# Altium project F407.PrjPcb
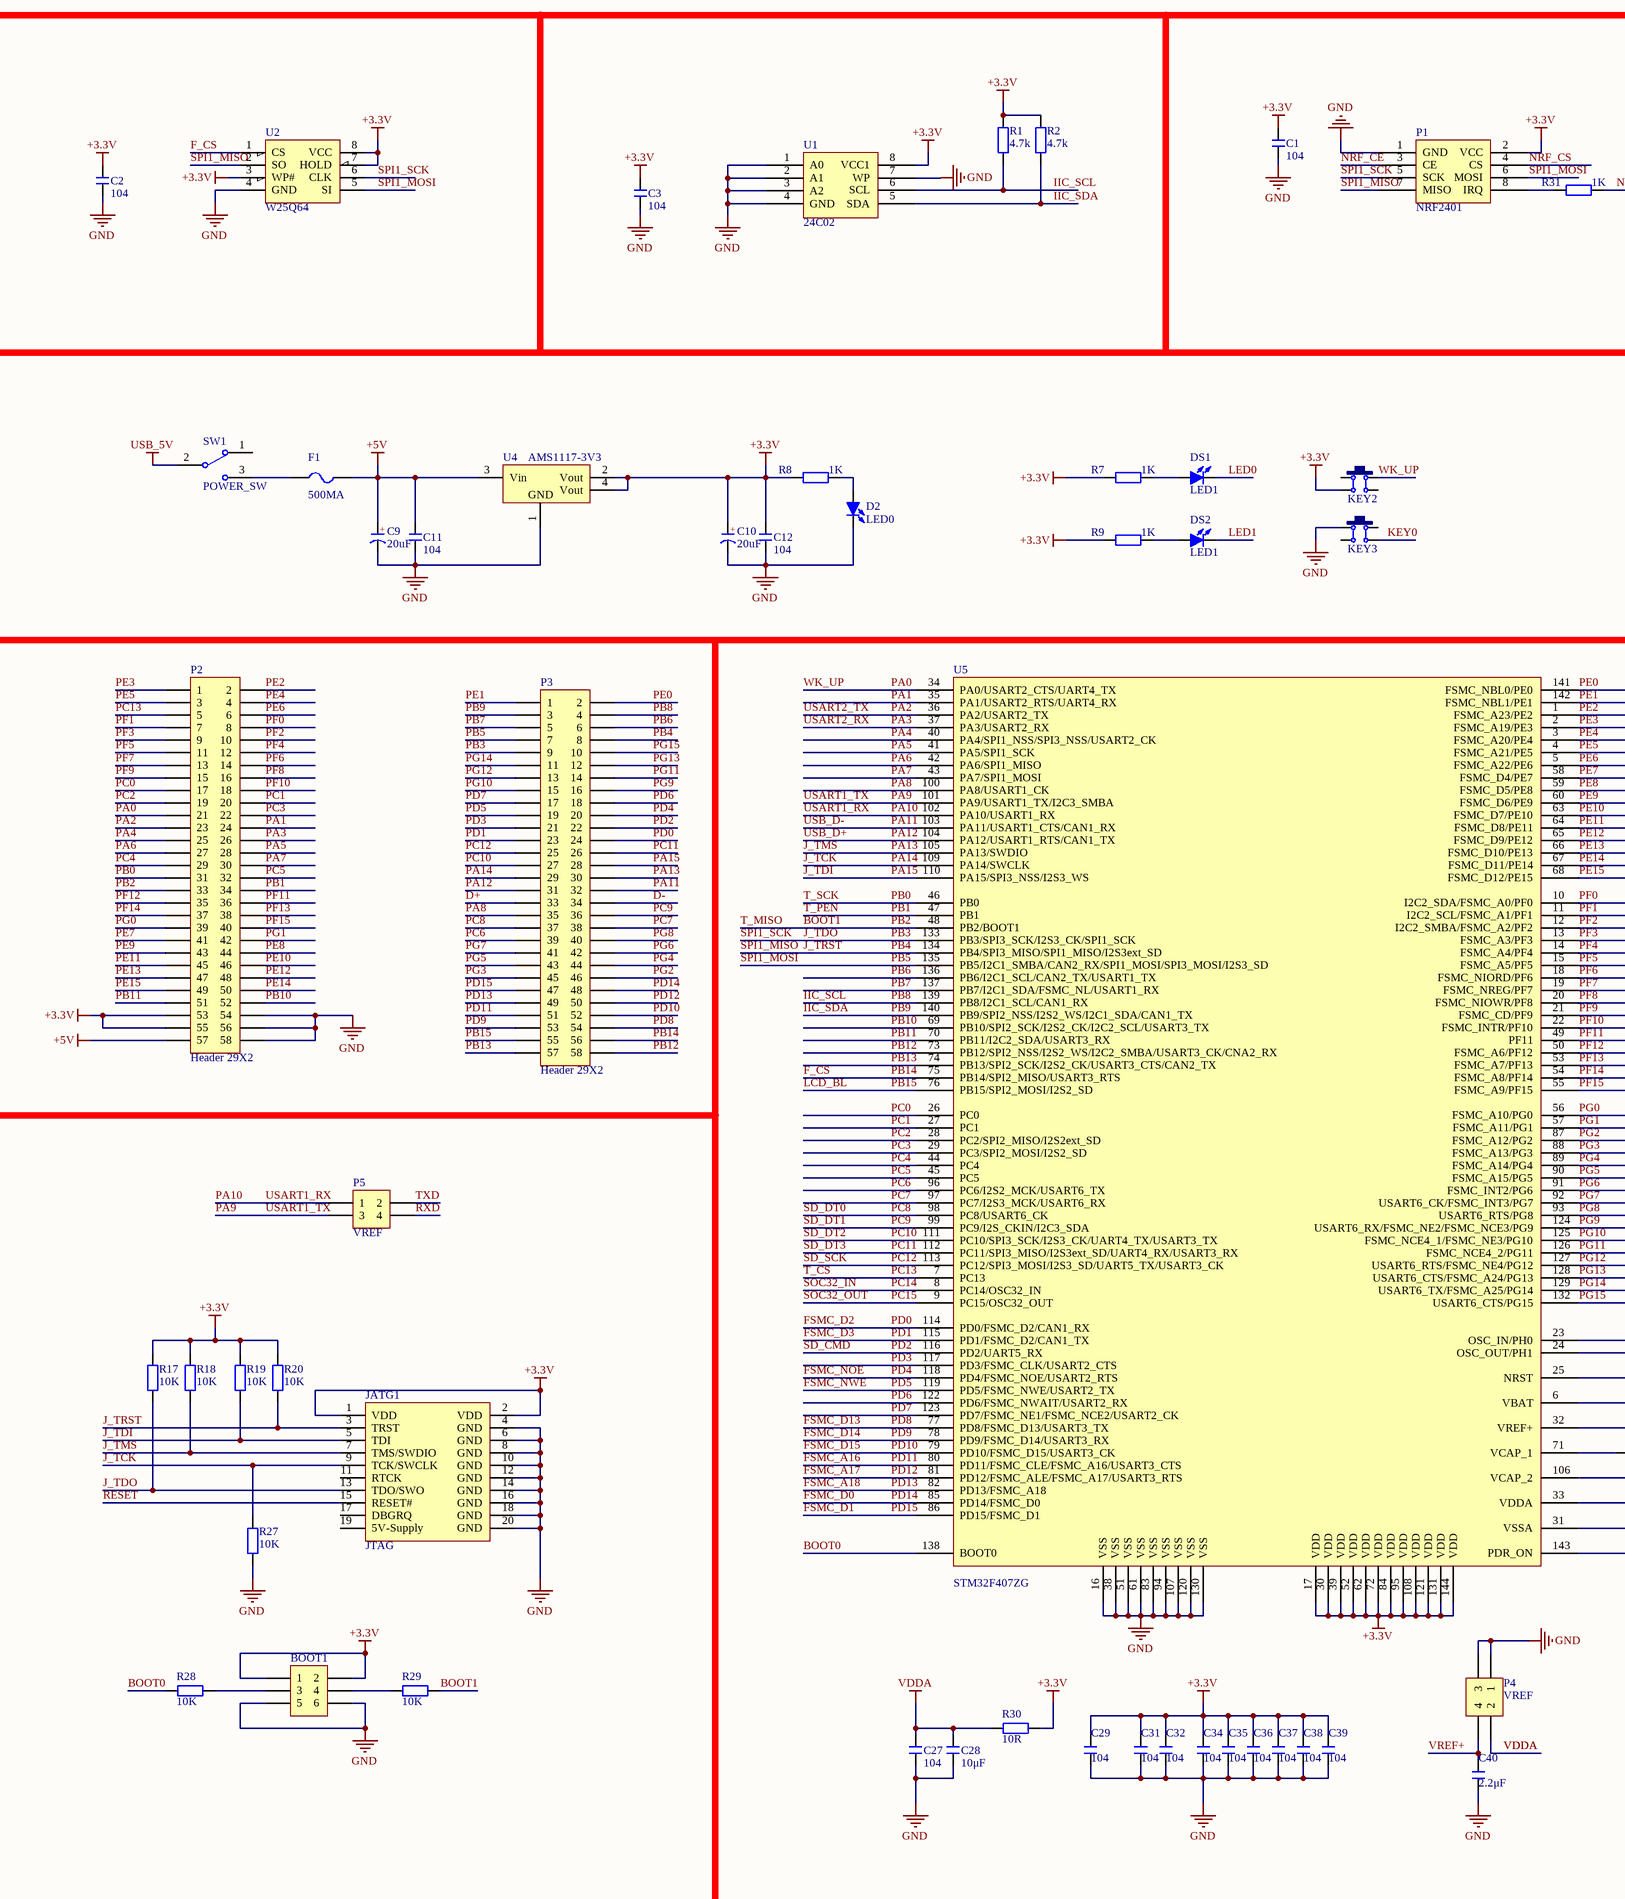
[diagram p0: F407.SchDoc, left]
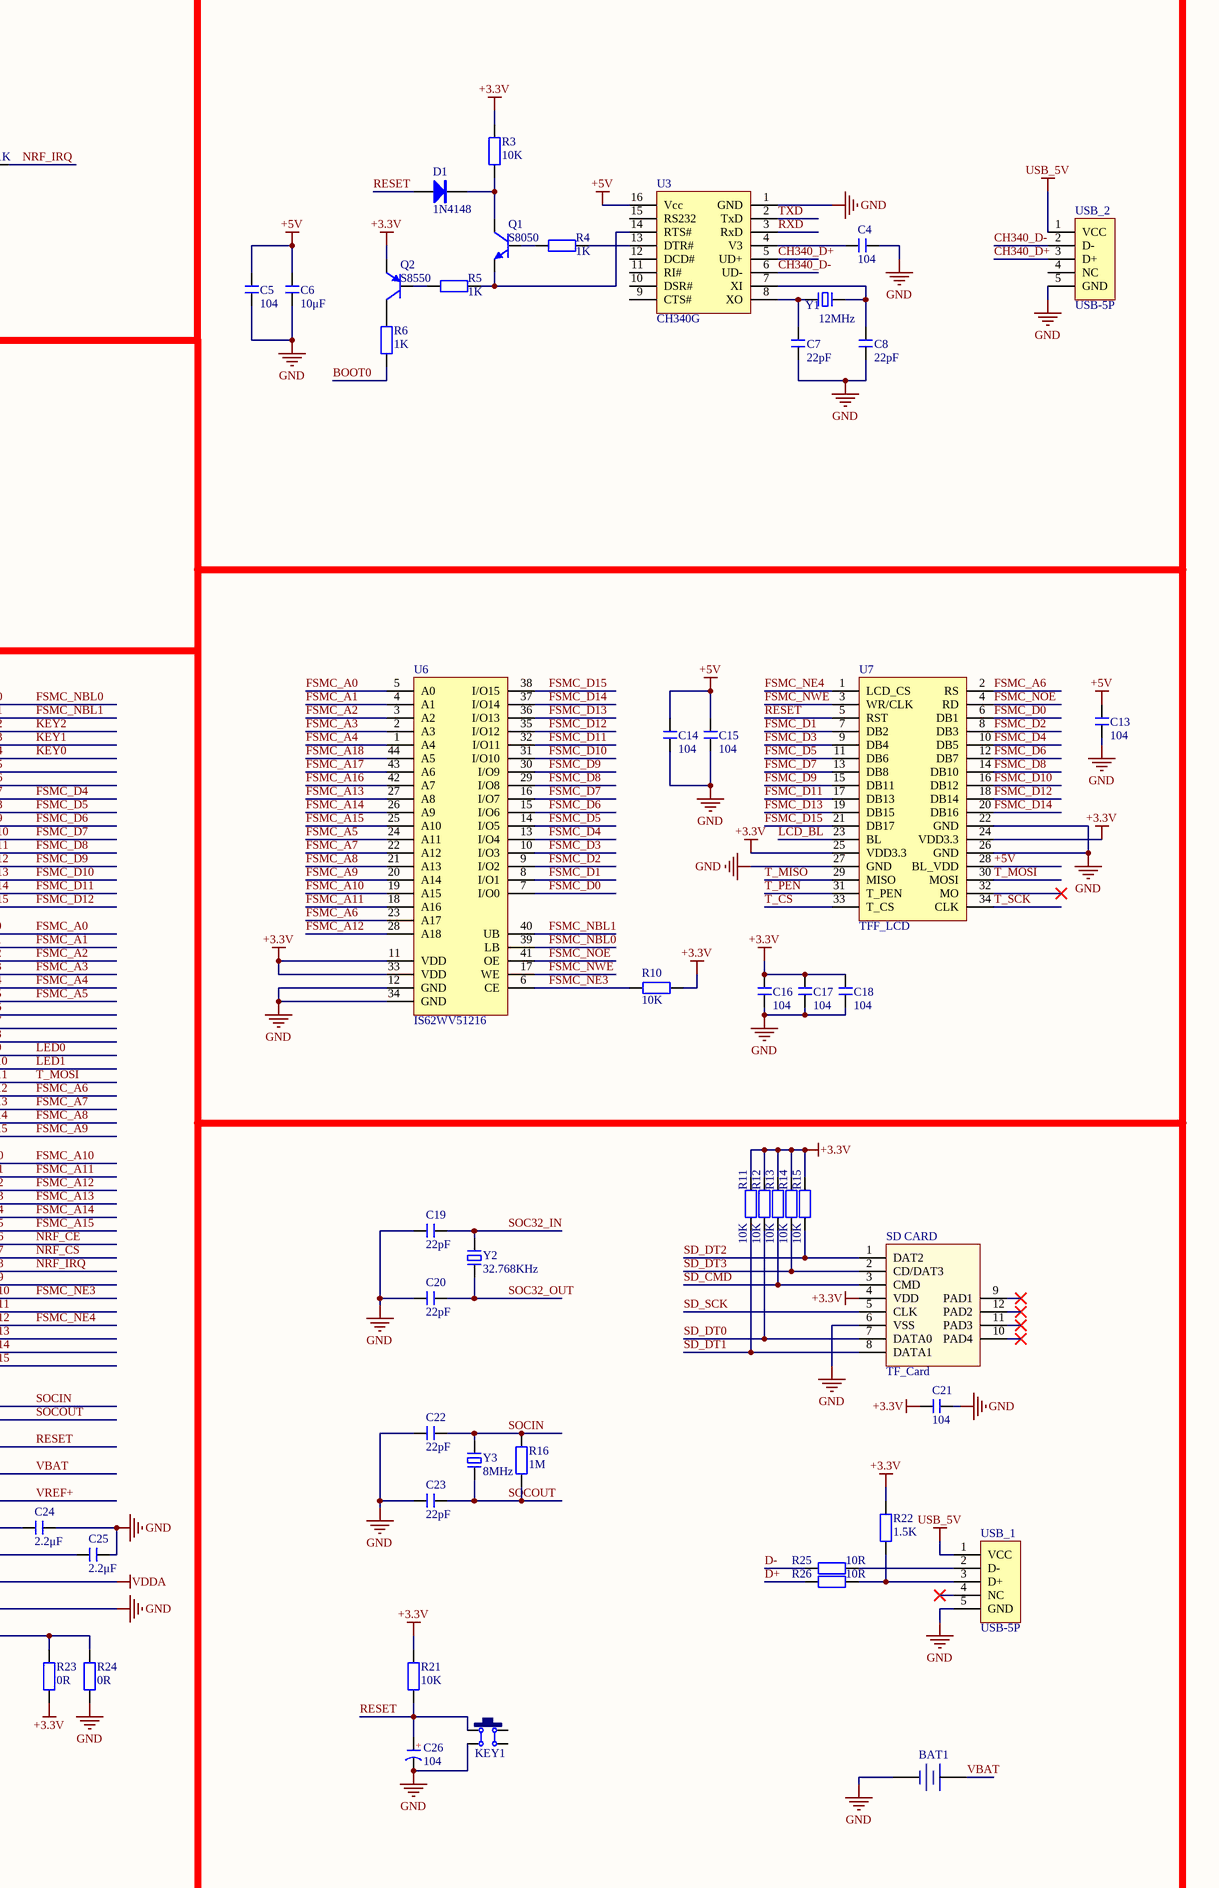
[diagram p1: F407.SchDoc, right]
1 sheet, 101 parts. Net scope: global (net labels, ports and power ports of the same name join across sheets).
Board files: F407.PcbDoc, PCB2.PcbDoc

## Sheet F407.SchDoc
size A2

### Parts
BAT1  1220  [CR1220_A]  (value not drawn)
BOOT1  BOOT1  [HDR2.54-LI-2x3P]  (value not drawn)
C1  104  [C 0603_L]
C2  104  [C 0603_L]
C3  104  [C 0603_L]
C4  104  [C 0603_L]
C5  104  [C 0603_L]
C6  10μF  [C 0603_L]
C7  22pF  [C 0603_L]
C8  22pF  [C 0603_L]
C9  20uF  [C 1206_L]
C10  20uF  [C 1206_L]
C11  104  [C 0603_L]
C12  104  [C 0603_L]
C13  104  [C 0603_L]
C14  104  [C 0603_L]
C15  104  [C 0603_L]
C16  104  [C 0603_L]
C17  104  [C 0603_L]
C18  104  [C 0603_L]
C19  22pF  [C 0603_L]
C20  22pF  [C 0603_L]
C21  104  [C 0603_L]
C22  22pF  [C 0603_L]
C23  22pF  [C 0603_L]
C24  2.2μF  [C 0603_L]
C25  2.2μF  [C 0603_L]
C26  104  [C 0603_L]
C27  104  [C 0603_L]
C28  10μF  [C 0603_L]
C29  104  [C 0603_L]
C31  104  [C 0603_L]
C32  104  [C 0603_L]
C34  104  [C 0603_L]
C35  104  [C 0603_L]
C36  104  [C 0603_L]
C37  104  [C 0603_L]
C38  104  [C 0603_L]
C39  104  [C 0603_L]
C40  2.2μF  [C 0603_L]
D1  1N4148  [MINI_MELF (LL34)]
D2  LED0  [LED 0805G]
DS1  LED1  [LED 0805G]
DS2  LED1  [LED 0805G]
F1  500MA  [FU 0805]
JATG1  JTAG  [HDR2.54-WI-2x10P]
KEY1  6x6x5  [TSW DIP-6*6*6]  (value not drawn)
KEY2  6x6x5  [TSW DIP-6*6*6]  (value not drawn)
KEY3  6x6x5  [TSW DIP-6*6*6]  (value not drawn)
P1  NRF2401  [HDR2.54-LI-2x4P]
P2  Header 29X2  [HEAD2*27]
P3  Header 29X2  [HEAD2*27]
P4  VREF  [HDR2.54-LI-2x2P]
P5  VREF  [HDR2.54-LI-2x2P]
Q1  S8050  [SOT23-3L]
Q2  S8550  [SOT23-3L]
R1  4.7k  [R 0603_L]
R2  4.7k  [R 0603_L]
R3  10K  [R 0603_L]
R4  1K  [R 0603_L]
R5  1K  [R 0603_L]
R6  1K  [R 0603_L]
R7  1K  [R 0603_L]
R8  1K  [R 0603_L]
R9  1K  [R 0603_L]
R10  10K  [R 0603_L]
R11  10K  [R 0603_L]
R12  10K  [R 0603_L]
R13  10K  [R 0603_L]
R14  10K  [R 0603_L]
R15  10K  [R 0603_L]
R16  1M  [R 0603_L]
R17  10K  [R 0603_L]
R18  10K  [R 0603_L]
R19  10K  [R 0603_L]
R20  10K  [R 0603_L]
R21  10K  [R 0603_L]
R22  1.5K  [R 0603_L]
R23  0R  [R 0603_L]
R24  0R  [R 0603_L]
R25  10R  [R 0603_L]
R26  10R  [R 0603_L]
R27  10K  [R 0603_L]
R28  10K  [R 0603_L]
R29  10K  [R 0603_L]
R30  10R  [R 0603_L]
R31  1K  [R 0603_L]
SD_CARD  TF_Card  [Micro SD]
SW1  POWER_SW  [SS-12D00]
U1  24C02  [SOP8_L]
U2  W25Q64  [SOP8W_L]
U3  CH340G  [SOP16_L]
U4  AMS1117-3V3  [SOT223_L]
U5  STM32F407ZG  [LQFP144 20X20_N]
U6  IS62WV51216  [TSOP10X18-44]
U7  TFF_LCD  [HDR2.54-LI-2x17P]
USB_1  USB-5P  [USB-MICRO_E]
USB_2  USB-5P  [USB-MICRO_E]
Y1  12MHz  [OSC HC-49SMD]
Y2  32.768KHz  [OSC-2x6-WI-B]
Y3  8MHz  [OSC HC-49SMD]

### Nets
+3.3V: BOOT1.1 BOOT1.2 C1.2 C2.2 C3.2 C10.1(A) C12.1 C16.2 C17.2 C18.2 C21.2 C29.1 C31.1 C32.1 C34.1 C35.1 C36.1 C37.1 C38.1 C39.1 JATG1.1(VDD) JATG1.2(VDD) KEY2.3 P1.2(VCC) P2.53 P2.55 Q2.2(E) R1.2 R2.2 R3.1 R7.2 R8.2 R9.2 R10.2 R11.2 R12.2 R13.2 R14.2 R15.2 R17.1 R18.1 R19.1 R20.1 R21.2 R22.2 R23.1 R30.2 SD_CARD.4(VDD) U1.8(VCC1) U2.3(WP#) U2.7(HOLD) U2.8(VCC) U4.2(Vout) U4.4(Vout) U5.17(VDD) U5.30(VDD) U5.39(VDD) U5.52(VDD) U5.62(VDD) U5.72(VDD) U5.84(VDD) U5.95(VDD) U5.108(VDD) U5.121(VDD) U5.131(VDD) U5.144(VDD) U6.11(VDD) U6.33(VDD) U7.24(VDD3.3) U7.25(VDD3.3)
+5V: C5.2 C6.2 C9.1(A) C11.1 C13.2 C14.2 C15.2 F1.2 P2.57 U3.16(Vcc) U4.3(Vin) U7.28(BL_VDD)
GND: BAT1.2(DC-) BOOT1.5 BOOT1.6 C1.1 C2.1 C3.1 C4.1 C5.1 C6.1 C7.2 C8.2 C9.2(K) C10.2(K) C11.2 C12.2 C13.1 C14.1 C15.1 C16.1 C17.1 C18.1 C19.2 C20.2 C21.1 C22.2 C23.2 C24.1 C25.1 C26.2(K) C27.2 C28.2 C29.2 C31.2 C32.2 C34.2 C35.2 C36.2 C37.2 C38.2 C39.2 C40.2 D2.2(K) JATG1.4(GND) JATG1.6(GND) JATG1.8(GND) JATG1.10(GND) JATG1.12(GND) JATG1.14(GND) JATG1.16(GND) JATG1.18(GND) JATG1.20(GND) KEY1.3 KEY3.1 P1.1(GND) P2.54 P2.56 P2.58 P4.1 P4.3 R24.1 R27.2 SD_CARD.6(VSS) U1.1(A0) U1.2(A1) U1.3(A2) U1.4(GND) U1.7(WP) U2.4(GND) U3.1(GND) U4.1(GND) U5.16(VSS) U5.31(VSSA) U5.38(VSS) U5.51(VSS) U5.61(VSS) U5.83(VSS) U5.94(VSS) U5.107(VSS) U5.120(VSS) U5.130(VSS) U6.12(GND) U6.34(GND) U7.22(GND) U7.26(GND) U7.27(GND) USB_1.5(GND) USB_2.5(GND)
USB_5V: SW1.2 USB_1.1(VCC) USB_2.1(VCC)
VDDA: C27.1 C28.1 P4.2 R30.1 U5.33(VDDA)
BOOT0: R6.2 R28.1 U5.138(BOOT0)
BOOT1: P2.33 R29.2 U5.48(PB2/BOOT1) U7.29(MISO)  [also labelled PB2, T_MISO]
CH340_D+: U3.5(UD+) USB_2.3(D+)
CH340_D-: U3.6(UD-) USB_2.2(D-)
D+: P3.33 R26.1
D-: P3.34 R25.1
F_CS: P3.56 U2.1(CS) U5.75(PB14/SPI2_MISO/USART3_RTS)  [also labelled PB14]
FSMC_A0: P2.8 U5.10(I2C2_SDA/FSMC_A0/PF0) U6.5(A0)  [also labelled PF0]
FSMC_A1: P2.7 U5.11(I2C2_SCL/FSMC_A1/PF1) U6.4(A1)  [also labelled PF1]
FSMC_A2: P2.10 U5.12(I2C2_SMBA/FSMC_A2/PF2) U6.3(A2)  [also labelled PF2]
FSMC_A3: P2.9 U5.13(FSMC_A3/PF3) U6.2(A3)  [also labelled PF3]
FSMC_A4: P2.12 U5.14(FSMC_A4/PF4) U6.1(A4)  [also labelled PF4]
FSMC_A5: P2.11 U5.15(FSMC_A5/PF5) U6.24(A11)  [also labelled PF5]
FSMC_A6: P2.35 U5.50(FSMC_A6/PF12) U6.23(A17) U7.2(RS)  [also labelled PF12]
FSMC_A7: P2.38 U5.53(FSMC_A7/PF13) U6.22(A12)  [also labelled PF13]
FSMC_A8: P2.37 U5.54(FSMC_A8/PF14) U6.21(A13)  [also labelled PF14]
FSMC_A9: P2.40 U5.55(FSMC_A9/PF15) U6.20(A14)  [also labelled PF15]
FSMC_A10: P2.39 U5.56(FSMC_A10/PG0) U6.19(A15)  [also labelled PG0]
FSMC_A11: P2.42 U5.57(FSMC_A11/PG1) U6.18(A16)  [also labelled PG1]
FSMC_A12: P3.46 U5.87(FSMC_A12/PG2) U6.28(A18)  [also labelled PG2]
FSMC_A13: P3.45 U5.88(FSMC_A13/PG3) U6.27(A8)  [also labelled PG3]
FSMC_A14: P3.44 U5.89(FSMC_A14/PG4) U6.26(A9)  [also labelled PG4]
FSMC_A15: P3.43 U5.90(FSMC_A15/PG5) U6.25(A10)  [also labelled PG5]
FSMC_A16: P3.51 U5.80(PD11/FSMC_CLE/FSMC_A16/USART3_CTS) U6.42(A7)  [also labelled PD11]
FSMC_A17: P3.50 U5.81(PD12/FSMC_ALE/FSMC_A17/USART3_RTS) U6.43(A6)  [also labelled PD12]
FSMC_A18: P3.49 U5.82(PD13/FSMC_A18) U6.44(A5)  [also labelled PD13]
FSMC_D0: P3.48 U5.85(PD14/FSMC_D0) U6.7(I/O0) U7.6(DB1)  [also labelled PD14]
FSMC_D1: P3.47 U5.86(PD15/FSMC_D1) U6.8(I/O1) U7.7(DB2)  [also labelled PD15]
FSMC_D2: P3.24 U5.114(PD0/FSMC_D2/CAN1_RX) U6.9(I/O2) U7.8(DB3)  [also labelled PD0]
FSMC_D3: P3.23 U5.115(PD1/FSMC_D2/CAN1_TX) U6.10(I/O3) U7.9(DB4)  [also labelled PD1]
FSMC_D4: P2.41 U5.58(FSMC_D4/PE7) U6.13(I/O4) U7.10(DB5)  [also labelled PE7]
FSMC_D5: P2.44 U5.59(FSMC_D5/PE8) U6.14(I/O5) U7.11(DB6)  [also labelled PE8]
FSMC_D6: P2.43 U5.60(FSMC_D6/PE9) U6.15(I/O6) U7.12(DB7)  [also labelled PE9]
FSMC_D7: P2.46 U5.63(FSMC_D7/PE10) U6.16(I/O7) U7.13(DB8)  [also labelled PE10]
FSMC_D8: P2.45 U5.64(FSMC_D8/PE11) U6.29(I/O8) U7.14(DB10)  [also labelled PE11]
FSMC_D9: P2.48 U5.65(FSMC_D9/PE12) U6.30(I/O9) U7.15(DB11)  [also labelled PE12]
FSMC_D10: P2.47 U5.66(FSMC_D10/PE13) U6.31(I/O10) U7.16(DB12)  [also labelled PE13]
FSMC_D11: P2.50 U5.67(FSMC_D11/PE14) U6.32(I/O11) U7.17(DB13)  [also labelled PE14]
FSMC_D12: P2.49 U5.68(FSMC_D12/PE15) U6.35(I/O12) U7.18(DB14)  [also labelled PE15]
FSMC_D13: P3.54 U5.77(PD8/FSMC_D13/USART3_TX) U6.36(I/O13) U7.19(DB15)  [also labelled PD8]
FSMC_D14: P3.53 U5.78(PD9/FSMC_D14/USART3_RX) U6.37(I/O14) U7.20(DB16)  [also labelled PD9]
FSMC_D15: P3.52 U5.79(PD10/FSMC_D15/USART3_CK) U6.38(I/O15) U7.21(DB17)  [also labelled PD10]
FSMC_NBL0: P3.2 U5.141(FSMC_NBL0/PE0) U6.39(LB)  [also labelled PE0]
FSMC_NBL1: P3.1 U5.142(FSMC_NBL1/PE1) U6.40(UB)  [also labelled PE1]
FSMC_NE3: P3.15 R10.1 U5.125(FSMC_NCE4_1/FSMC_NE3/PG10) U6.6(CE)  [also labelled PG10]
FSMC_NE4: P3.13 U5.127(USART6_RTS/FSMC_NE4/PG12) U7.1(LCD_CS)  [also labelled PG12]
FSMC_NOE: P3.20 U5.118(PD4/FSMC_NOE/USART2_RTS) U6.41(OE) U7.4(RD)  [also labelled PD4]
FSMC_NWE: P3.19 U5.119(PD5/FSMC_NWE/USART2_TX) U6.17(WE) U7.3(WR/CLK)  [also labelled PD5]
IIC_SCL: P3.4 R1.1 U1.6(SCL) U5.139(PB8/I2C1_SCL/CAN1_RX)  [also labelled PB8]
IIC_SDA: P3.3 R2.1 U1.5(SDA) U5.140(PB9/SPI2_NSS/I2S2_WS/I2C1_SDA/CAN1_TX)  [also labelled PB9]
J_TCK: JATG1.9(TCK/SWCLK) P3.29 R27.1 U5.109(PA14/SWCLK)  [also labelled PA14]
J_TDI: JATG1.5(TDI) P3.28 R19.2 U5.110(PA15/SPI3_NSS/I2S3_WS)  [also labelled PA15]
J_TDO: JATG1.13(TDO/SWO) P1.5(SCK) P3.9 R17.2 U2.6(CLK) U5.133(PB3/SPI3_SCK/I2S3_CK/SPI1_SCK)  [also labelled PB3, SPI1_SCK]
J_TMS: JATG1.7(TMS/SWDIO) P3.30 R18.2 U5.105(PA13/SWDIO)  [also labelled PA13]
J_TRST: JATG1.3(TRST) P1.7(MISO) P3.8 R20.2 U2.2(SO) U5.134(PB4/SPI3_MISO/SPI1_MISO/I2S3ext_SD)  [also labelled PB4, SPI1_MISO]
KEY0: KEY3.3 P2.4 U5.3(FSMC_A20/PE4)  [also labelled PE4]
KEY1: P2.1 U5.2(FSMC_A19/PE3)  [also labelled PE3]
KEY2: P2.2 U5.1(FSMC_A23/PE2)  [also labelled PE2]
LCD_BL: P3.55 U5.76(PB15/SPI2_MOSI/I2S2_SD) U7.23(BL)  [also labelled PB15]
LED0: DS1.2(K) P2.15 U5.21(FSMC_CD/PF9)  [also labelled PF9]
LED1: DS2.2(K) P2.18 U5.22(FSMC_INTR/PF10)  [also labelled PF10]
NRF_CE: P1.3(CE) P3.42 U5.91(FSMC_INT2/PG6)  [also labelled PG6]
NRF_CS: P1.4(CS) P3.41 U5.92(USART6_CK/FSMC_INT3/PG7)  [also labelled PG7]
NRF_IRQ: P3.40 R31.1 U5.93(USART6_RTS/PG8)  [also labelled PG8]
PA0: KEY2.1 P2.21 U5.34(PA0/USART2_CTS/UART4_TX)  [also labelled WK_UP]
PA1: P2.24 U5.35(PA1/USART2_RTS/UART4_RX)
PA2: P2.23 U5.36(PA2/USART2_TX)  [also labelled USART2_TX]
PA3: P2.26 U5.37(PA3/USART2_RX)  [also labelled USART2_RX]
PA4: P2.25 U5.40(PA4/SPI1_NSS/SPI3_NSS/USART2_CK)
PA5: P2.28 U5.41(PA5/SPI1_SCK)
PA6: P2.27 U5.42(PA6/SPI1_MISO)
PA7: P2.30 U5.43(PA7/SPI1_MOSI)
PA8: P3.35 U5.100(PA8/USART1_CK)
PA9: P5.3 U5.101(PA9/USART1_TX/I2C3_SMBA)  [also labelled USART1_TX]
PA10: P5.1 U5.102(PA10/USART1_RX)  [also labelled USART1_RX]
PA11: P3.32 U5.103(PA11/USART1_CTS/CAN1_RX)  [also labelled USB_D-]
PA12: P3.31 U5.104(PA12/USART1_RTS/CAN1_TX)  [also labelled USB_D+]
PB0: P2.31 U5.46(PB0) U7.34(CLK)  [also labelled T_SCK]
PB1: P2.34 U5.47(PB1) U7.31(T_PEN)  [also labelled T_PEN]
PB5: P1.6(MOSI) P3.7 U2.5(SI) U5.135(PB5/I2C1_SMBA/CAN2_RX/SPI1_MOSI/SPI3_MOSI/I2S3_SD)  [also labelled SPI1_MOSI]
PB6: P3.6 U5.136(PB6/I2C1_SCL/CAN2_TX/USART1_TX)
PB7: P3.5 U5.137(PB7/I2C1_SDA/FSMC_NL/USART1_RX)
PB10: P2.52 U5.69(PB10/SPI2_SCK/I2S2_CK/I2C2_SCL/USART3_TX)
PB11: P2.51 U5.70(PB11/I2C2_SDA/USART3_RX)
PB12: P3.58 U5.73(PB12/SPI2_NSS/I2S2_WS/I2C2_SMBA/USART3_CK/CNA2_RX)
PB13: P3.57 U5.74(PB13/SPI2_SCK/I2S2_CK/USART3_CTS/CAN2_TX)
PC0: P2.17 U5.26(PC0)
PC1: P2.20 U5.27(PC1)
PC2: P2.19 U5.28(PC2/SPI2_MISO/I2S2ext_SD)
PC3: P2.22 U5.29(PC3/SPI2_MOSI/I2S2_SD)
PC4: P2.29 U5.44(PC4)
PC5: P2.32 U5.45(PC5)
PC6: P3.39 U5.96(PC6/I2S2_MCK/USART6_TX)
PC7: P3.38 U5.97(PC7/I2S3_MCK/USART6_RX)
PC8: P3.37 R12.1 SD_CARD.7(DATA0) U5.98(PC8/USART6_CK)  [also labelled SD_DT0]
PC9: P3.36 R11.1 SD_CARD.8(DATA1) U5.99(PC9/I2S_CKIN/I2C3_SDA)  [also labelled SD_DT1]
PC10: P3.27 R15.1 SD_CARD.1(DAT2) U5.111(PC10/SPI3_SCK/I2S3_CK/UART4_TX/USART3_TX)  [also labelled SD_DT2]
PC11: P3.26 R14.1 SD_CARD.2(CD/DAT3) U5.112(PC11/SPI3_MISO/I2S3ext_SD/UART4_RX/USART3_RX)  [also labelled SD_DT3]
PC12: P3.25 SD_CARD.5(CLK) U5.113(PC12/SPI3_MOSI/I2S3_SD/UART5_TX/USART3_CK)  [also labelled SD_SCK]
PC13: P2.5 U5.7(PC13) U7.33(T_CS)  [also labelled T_CS]
PC14: C19.1 U5.8(PC14/OSC32_IN) Y2.1  [also labelled SOC32_IN]
PC15: C20.1 U5.9(PC15/OSC32_OUT) Y2.2  [also labelled SOC32_OUT]
PD2: P3.22 R13.1 SD_CARD.3(CMD) U5.116(PD2/UART5_RX)  [also labelled SD_CMD]
PD3: P3.21 U5.117(PD3/FSMC_CLK/USART2_CTS)
PD6: P3.18 U5.122(PD6/FSMC_NWAIT/USART2_RX)
PD7: P3.17 U5.123(PD7/FSMC_NE1/FSMC_NCE2/USART2_CK)
PE5: P2.3 U5.4(FSMC_A21/PE5)
PE6: P2.6 U5.5(FSMC_A22/PE6)
PF6: P2.14 U5.18(FSMC_NIORD/PF6)
PF7: P2.13 U5.19(FSMC_NREG/PF7)
PF8: P2.16 U5.20(FSMC_NIOWR/PF8)
PF11: P2.36 U5.49(PF11) U7.30(MOSI)  [also labelled T_MOSI]
PG9: P3.16 U5.124(USART6_RX/FSMC_NE2/FSMC_NCE3/PG9)
PG11: P3.14 U5.126(FSMC_NCE4_2/PG11)
PG13: P3.12 U5.128(USART6_CTS/FSMC_A24/PG13)
PG14: P3.11 U5.129(USART6_TX/FSMC_A25/PG14)
PG15: P3.10 U5.132(USART6_CTS/PG15)
RESET: C26.1(A) D1.1(A) JATG1.15(RESET#) KEY1.2 R21.1 U5.25(NRST) U7.5(RST)
RXD: P5.4 U3.3(RxD)
SOCIN: C22.1 R16.2 U5.23(OSC_IN/PH0) Y3.1
SOCOUT: C23.1 R16.1 U5.24(OSC_OUT/PH1) Y3.2
TXD: P5.2 U3.2(TxD)
VBAT: BAT1.1(DC+) U5.6(VBAT)
VREF+: C40.1 P4.4 U5.32(VREF+)
NetBOOT1_3: BOOT1.3 R28.2
NetBOOT1_4: BOOT1.4 R29.1
NetC4_2: C4.2 U3.4(V3)
NetC7_1: C7.1 U3.8(XO) Y1.2
NetC8_1: C8.1 U3.7(XI) Y1.1
NetC24_2: C24.2 U5.71(VCAP_1)
NetC25_2: C25.2 U5.106(VCAP_2)
NetD1_2: D1.2(K) Q1.3(C) R3.2
NetD2_1: D2.1(A) R8.1
NetDS1_1: DS1.1(A) R7.1
NetDS2_1: DS2.1(A) R9.1
NetF1_1: F1.1 SW1.3
NetP1_8: P1.8(IRQ) R31.2
NetQ1_1: Q1.1(B) R4.2
NetQ1_2: Q1.2(E) R5.1 U3.14(RTS#)
NetQ2_1: Q2.1(B) R5.2
NetQ2_3: Q2.3(C) R6.1
NetR4_1: R4.1 U3.13(DTR#)
NetR22_1: R22.1 R26.2 USB_1.3(D+)
NetR23_2: R23.2 R24.2 U5.143(PDR_ON)
NetR25_2: R25.2 USB_1.2(D-)

Not connected (* = marked no-connect by the designer): JATG1 11(RTCK) 17(DBGRQ) 19(5V-Supply); KEY1 1 4; KEY2 2 4; KEY3 2 4; SD_CARD 9(PAD1)* 10(PAD4)* 11(PAD3)* 12(PAD2)*; SW1 1; U3 9(CTS#) 10(DSR#) 11(RI#) 12(DCD#) 15(RS232); U7 32(MO)*; USB_1 4(NC)*; USB_2 4(NC)

### Notes on the sheet
- Title
- Size:
- Date:
- File:
- A2
- Number:
- Time:
- Revision:
- Sheet
- of
- (in symbol C-CD) +

### Library data of the parts
BAT1 = CR-3V: 微型电池; 版权归属: 源创客; BOM名称: 微型电池; 学习资源: www.ooocke.com
C1-C8 C11-C25 C27-C29 C31 C32 C34-C40 = C: 无极性贴片电容; 版权归属: 源创客; BOM名称: 无极性贴片电容; 学习资源: www.ooocke.com
C9 C10 C26 = C-CD: 贴片钽电容; 版权归属: 源创客; BOM名称: 贴片钽电容; 学习资源: www.ooocke.com
D1 = 1N4148: 高速开关二极管; 版权归属: 源创客; BOM名称: 高速开关二极管; 学习资源: www.ooocke.com
D2 DS1 DS2 = LED-SMD: 贴片LED; 版权归属: 源创客; BOM名称: 贴片LED; 学习资源: www.ooocke.com
F1 = FU: 贴片保险丝; 版权归属: 源创客; BOM名称: 贴片保险丝; 学习资源: www.ooocke.com
KEY1-KEY3 = TSW DIP-6x6: 直插6x6轻触开关; 版权归属: 源创客; BOM名称: 直插6x6轻触开关; 学习资源: www.ooocke.com
P2 P3 = Header 29X2: Header, 29-Pin, Dual row; LatestRevisionDate: 17-Jul-2002; LatestRevisionNote: Re-released for DXP Platform.; Publisher: Altium Limited
Q1 = 8050-SMD: 高频放大-NPN型; 版权归属: 源创客; 属性: 40V 1.5A 1W 100MHZ; BOM名称: 高频放大-NPN型; 学习资源: www.ooocke.com
Q2 = 8550-SMD: 高频放大-PNP型; 版权归属: 源创客; 属性: 40V 1.5A 1W 100MHZ; BOM名称: 高频放大-PNP型; 学习资源: www.ooocke.com
R1-R31 = R: 贴片电阻; 版权归属: 源创客; BOM名称: 贴片电阻; 学习资源: www.ooocke.com
SD_CARD = sd_Card: TF卡座; 版权归属: 源创客; BOM名称: TF卡座; 学习资源: www.ooocke.com
SW1 = SSW-1P: 1路波动开关; BOM名称: 波动开关; 版权归属: 源创客; 学习资源: www.ooocke.com
U1 = 24C02: 外置EEPROM; 版权归属: 源创客; BOM名称: 外置EEPROM; 学习资源: www.ooocke.com
U2 = W25X64: 外置Flash; 版权归属: 源创客; BOM名称: 外置Flash; 学习资源: www.ooocke.com
U3 = CH340G: 串口转USB; 版权归属: 源创客; BOM名称: 串口转USB; 学习资源: www.ooocke.com
U4 = AMS1117: 三端稳压芯片; BOM名称: 稳压芯片; 版权归属: 源创客; 学习资源: www.ooocke.com
U5 = STM32F407ZG: Flaah:1024/RAM:192/IO:114; BOM名称: 32位ST单片机; 版权归属: 源创客; 学习资源: www.ooocke.com
USB_1 USB_2 = USB-5P: 微型USB母座; 版权归属: 源创客; BOM名称: 微型USB母座; 学习资源: www.ooocke.com
Y1-Y3 = XTAL-2P: 2脚无源脚晶振; 版权归属: 源创客; BOM名称: 2脚无源脚晶振; 学习资源: www.ooocke.com